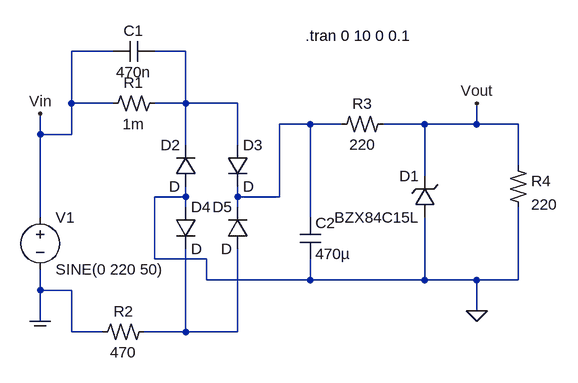
[diagram p0: schematic Capacitive Transformerless.asc]
Capacitive Transformerless.asc, the LTspice schematic file:
Version 4
SHEET 1 1112 680
WIRE 240 48 176 48
WIRE 352 48 304 48
WIRE 176 128 176 48
WIRE 240 128 176 128
WIRE 352 128 352 48
WIRE 352 128 304 128
WIRE 432 128 352 128
WIRE 544 160 496 160
WIRE 592 160 544 160
WIRE 720 160 656 160
WIRE 800 160 800 128
WIRE 800 160 720 160
WIRE 864 160 800 160
WIRE 128 176 128 144
WIRE 176 176 176 128
WIRE 176 176 128 176
WIRE 352 192 352 128
WIRE 432 192 432 128
WIRE 864 224 864 160
WIRE 720 240 720 160
WIRE 352 272 352 256
WIRE 352 272 304 272
WIRE 432 272 432 256
WIRE 496 272 496 160
WIRE 496 272 432 272
WIRE 352 288 352 272
WIRE 432 288 432 272
WIRE 128 304 128 176
WIRE 544 304 544 160
WIRE 304 368 304 272
WIRE 384 368 304 368
WIRE 384 400 384 368
WIRE 544 400 544 368
WIRE 544 400 384 400
WIRE 720 400 720 304
WIRE 720 400 544 400
WIRE 800 400 720 400
WIRE 864 400 864 288
WIRE 864 400 800 400
WIRE 128 416 128 384
WIRE 176 416 128 416
WIRE 800 448 800 400
WIRE 128 464 128 416
WIRE 176 480 176 416
WIRE 224 480 176 480
WIRE 352 480 352 352
WIRE 352 480 288 480
WIRE 432 480 432 352
WIRE 432 480 352 480
FLAG 800 448 0
FLAG 128 464 COM
FLAG 800 128 Vout
FLAG 128 144 Vin
SYMBOL voltage 128 288 R0
SYMATTR InstName V1
SYMATTR Value SINE(0 220 50)
SYMBOL res2 304 112 R90
WINDOW 0 0 32 VBottom 2
WINDOW 3 32 32 VTop 2
SYMATTR InstName R1
SYMATTR Value 1m
SYMBOL res2 288 464 R90
WINDOW 0 0 32 VBottom 2
WINDOW 3 32 32 VTop 2
SYMATTR InstName R2
SYMATTR Value 470
SYMBOL res2 656 144 R90
WINDOW 0 0 32 VBottom 2
WINDOW 3 32 32 VTop 2
SYMATTR InstName R3
SYMATTR Value 220
SYMBOL cap 304 32 R90
WINDOW 0 0 32 VBottom 2
WINDOW 3 32 32 VTop 2
SYMATTR InstName C1
SYMATTR Value 470n
SYMBOL cap 528 304 R0
SYMATTR InstName C2
SYMATTR Value 470µ
SYMBOL zener 736 304 R180
WINDOW 0 24 64 Left 2
WINDOW 3 24 0 Left 2
SYMATTR InstName D1
SYMATTR Value BZX84C15L
SYMBOL diode 368 256 R180
WINDOW 0 24 64 Left 2
WINDOW 3 24 0 Left 2
SYMATTR InstName D2
SYMBOL diode 416 192 R0
SYMATTR InstName D3
SYMBOL diode 336 288 R0
SYMATTR InstName D4
SYMBOL diode 448 352 R180
WINDOW 0 24 64 Left 2
WINDOW 3 24 0 Left 2
SYMATTR InstName D5
SYMBOL res2 848 224 R0
SYMATTR InstName R4
SYMATTR Value 220
TEXT 536 24 Left 2 !.tran 0 10 0 0.1

The netlist it stands for:
* Capacitive Transformerless.asc
V1 Vin COM SINE(0 220 50)
R1 N001 Vin 1m
R2 N003 COM 470
R3 Vout N002 220
C1 N001 Vin 470n
C2 N002 0 470µ
D1 0 Vout BZX84C15L
D2 0 N001 D
D3 N001 N002 D
D4 0 N003 D
D5 N003 N002 D
R4 Vout 0 220
.model D D
.lib standard.dio
.tran 0 10 0 0.1
.backanno
.end